# Altium project TablePCB2.PrjPcb
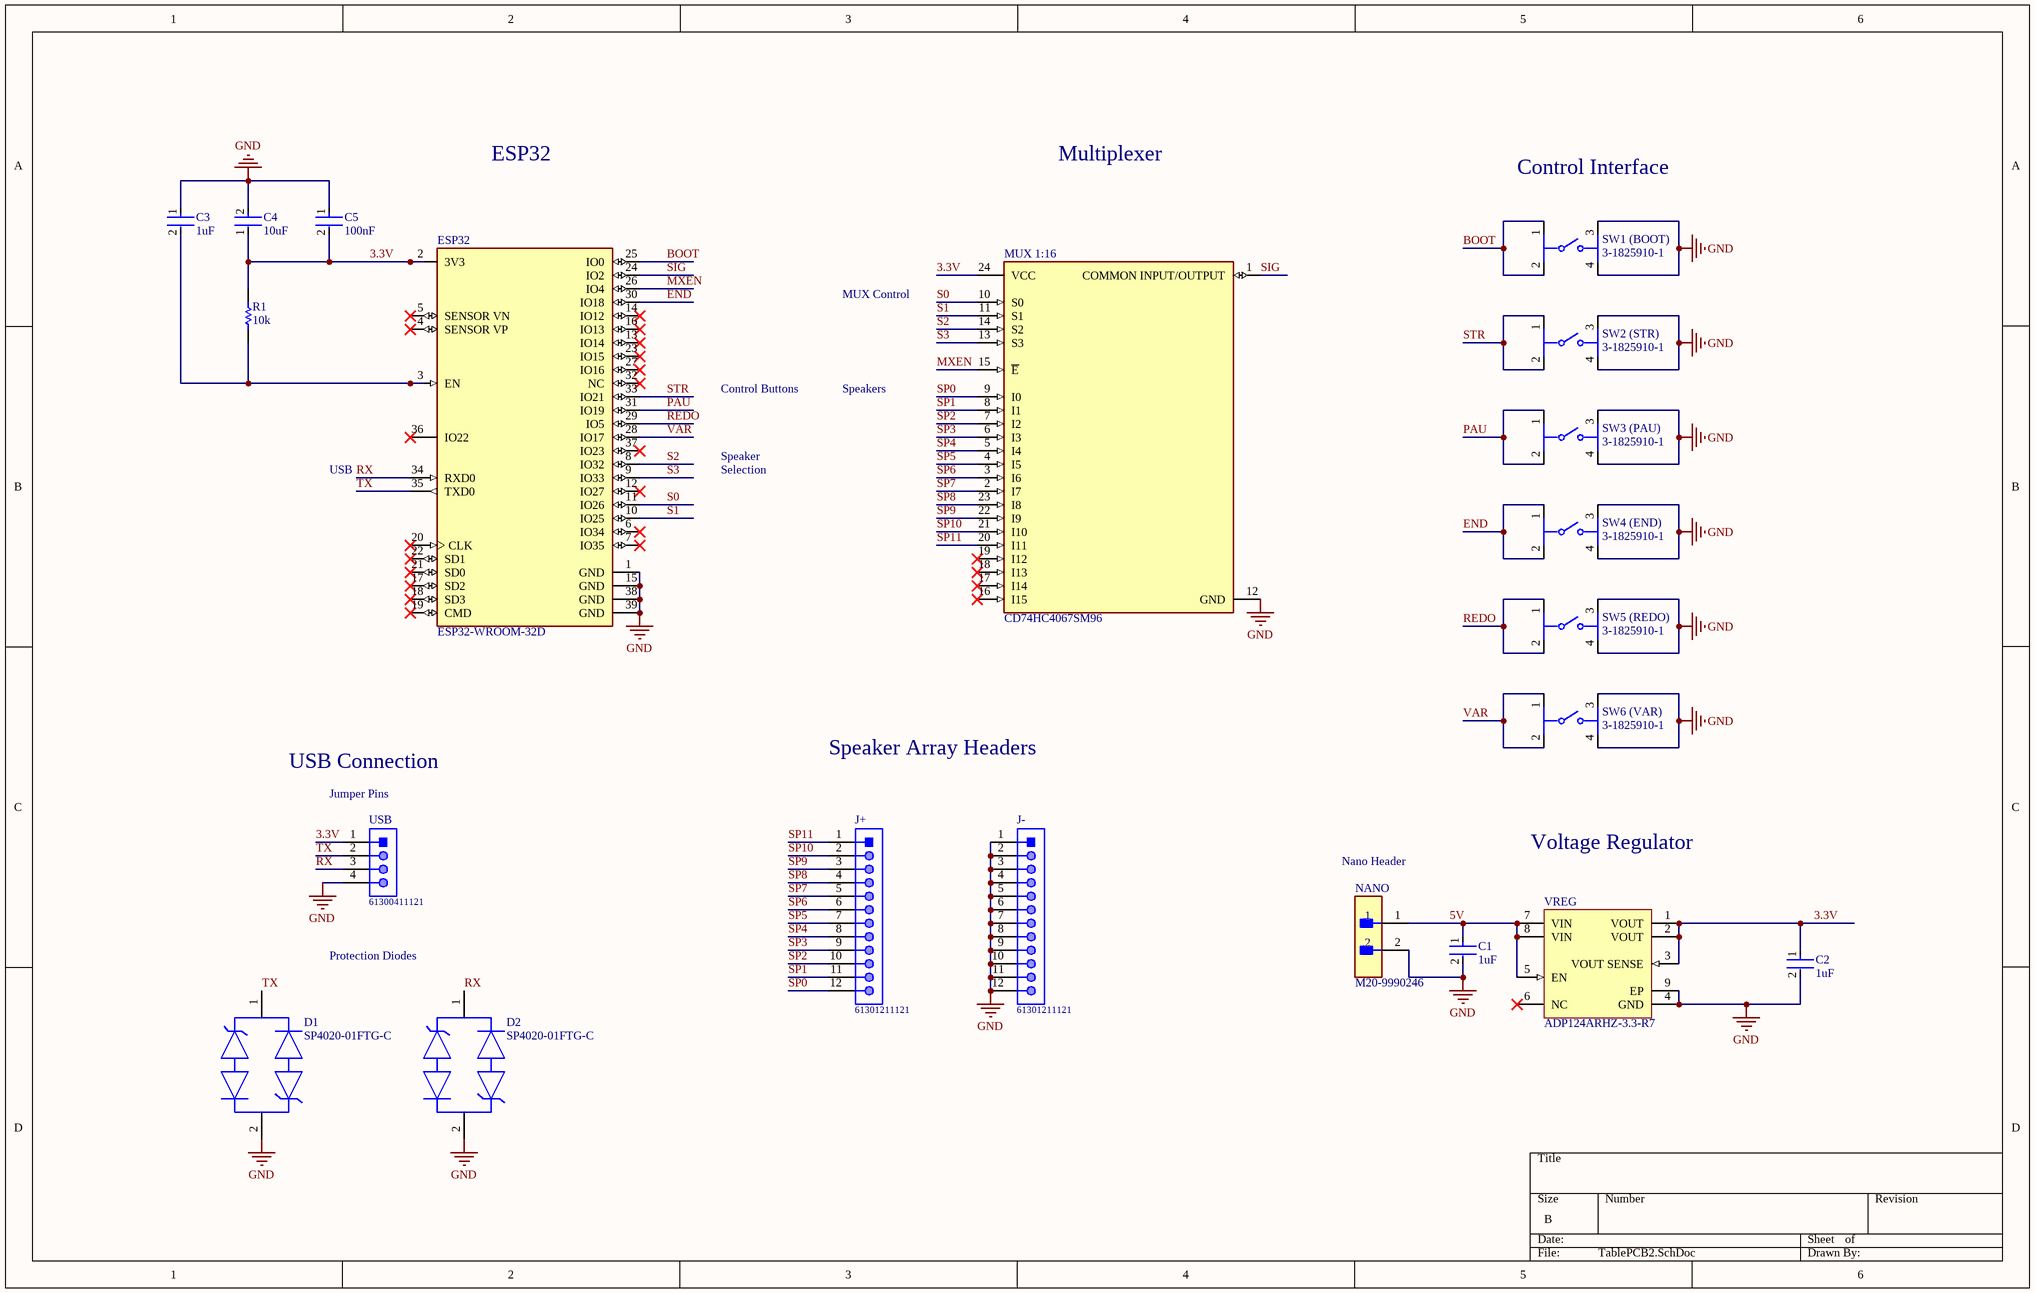
[diagram p0: TablePCB2.SchDoc]
1 sheet, 21 parts. Net scope: global (net labels, ports and power ports of the same name join across sheets).
Board file: TablePCB2.PcbDoc

## Sheet TablePCB2.SchDoc
size B; SheetNumber: 1; SheetTotal: 1

### Parts
C1  1uF  [FP-GRM15-0_1-MFG]
C2  1uF  [FP-GRM15-0_1-MFG]
C3  1uF  [FP-GRM15-0_1-MFG]
C4  10uF  [FP-C1608-080-0_1-MFG]
C5  100nF  [FP-C0402-BB-MFG]
D1  SP4020-01FTG-C  [FP-SP4020-MFG]
D2  SP4020-01FTG-C  [FP-SP4020-MFG]
ESP32  ESP32-WROOM-32D  [FP-ESP32-WROOM-32D-MFG]
J+  61301211121  [61301211121]
J-  61301211121  [61301211121]
MUX_1:16  CD74HC4067SM96  [FP-DB0024A-IPC_C]
NANO  M20-9990246  [FP-M20-9990246-MFG]
R1  10k  [RESC1609X55X30LL15T15]
SW1_(BOOT)  3-1825910-1  [FP-3-1825910-1-MFG]
SW2_(STR)  3-1825910-1  [FP-3-1825910-1-MFG]
SW3_(PAU)  3-1825910-1  [FP-3-1825910-1-MFG]
SW4_(END)  3-1825910-1  [FP-3-1825910-1-MFG]
SW5_(REDO)  3-1825910-1  [FP-3-1825910-1-MFG]
SW6_(VAR)  3-1825910-1  [FP-3-1825910-1-MFG]
USB  61300411121  [61300411121]
VREG  ADP124ARHZ-3.3-R7  [ADI-RH-8-1_N]

### Nets
GND: C1.2 C2.2 C3.1 C4.2 C5.1 D1.2 D2.2 ESP32.1(GND) ESP32.15(GND) ESP32.38(GND) ESP32.39(GND) J-.1 J-.2 J-.3 J-.4 J-.5 J-.6 J-.7 J-.8 J-.9 J-.10 J-.11 J-.12 MUX_1:16.12(GND) NANO.2 SW1_(BOOT).3 SW1_(BOOT).4 SW2_(STR).3 SW2_(STR).4 SW3_(PAU).3 SW3_(PAU).4 SW4_(END).3 SW4_(END).4 SW5_(REDO).3 SW5_(REDO).4 SW6_(VAR).3 SW6_(VAR).4 USB.4 VREG.4(GND) VREG.9(EP)
3.3V: C2.1 C4.1 C5.2 ESP32.2(3V3) MUX_1:16.24(VCC) R1.2 USB.1 VREG.1(VOUT) VREG.2(VOUT) VREG.3(VOUT_SENSE)
5V: C1.1 NANO.1 VREG.5(EN) VREG.7(VIN) VREG.8(VIN)
BOOT: ESP32.25(IO0) SW1_(BOOT).1 SW1_(BOOT).2
END: ESP32.30(IO18) SW4_(END).1 SW4_(END).2
MXEN: ESP32.26(IO4) MUX_1:16.15(~{E})
PAU: ESP32.31(IO19) SW3_(PAU).1 SW3_(PAU).2
REDO: ESP32.29(IO5) SW5_(REDO).1 SW5_(REDO).2
RX: D2.1 ESP32.34(RXD0) USB.3
S0: ESP32.11(IO26) MUX_1:16.10(S0)
S1: ESP32.10(IO25) MUX_1:16.11(S1)
S2: ESP32.8(IO32) MUX_1:16.14(S2)
S3: ESP32.9(IO33) MUX_1:16.13(S3)
SIG: ESP32.24(IO2) MUX_1:16.1(COMMON_INPUT/OUTPUT)
SP0: J+.12 MUX_1:16.9(I0)
SP1: J+.11 MUX_1:16.8(I1)
SP2: J+.10 MUX_1:16.7(I2)
SP3: J+.9 MUX_1:16.6(I3)
SP4: J+.8 MUX_1:16.5(I4)
SP5: J+.7 MUX_1:16.4(I5)
SP6: J+.6 MUX_1:16.3(I6)
SP7: J+.5 MUX_1:16.2(I7)
SP8: J+.4 MUX_1:16.23(I8)
SP9: J+.3 MUX_1:16.22(I9)
SP10: J+.2 MUX_1:16.21(I10)
SP11: J+.1 MUX_1:16.20(I11)
STR: ESP32.33(IO21) SW2_(STR).1 SW2_(STR).2
TX: D1.1 ESP32.35(TXD0) USB.2
VAR: ESP32.28(IO17) SW6_(VAR).1 SW6_(VAR).2
NetC3_2: C3.2 ESP32.3(EN) R1.1

Not connected (* = marked no-connect by the designer): ESP32 4(SENSOR_VP)* 5(SENSOR_VN)* 6(IO34)* 7(IO35)* 12(IO27)* 13(IO14)* 14(IO12)* 16(IO13)* 17(SD2)* 18(SD3)* 19(CMD)* 20(CLK)* 21(SD0)* 22(SD1)* 23(IO15)* 27(IO16)* 32(NC)* 36(IO22)* 37(IO23)*; MUX_1:16 16(I15)* 17(I14)* 18(I13)* 19(I12)*; VREG 6(NC)*

### Notes on the sheet
- ESP32
- Multiplexer
- Control Interface
- MUX Control
- Control Buttons
- Speakers
- USB
- Speaker
- Selection
- USB Connection
- Speaker Array Headers
- (near USB) Jumper Pins
- Nano Header
- Voltage Regulator
- Protection Diodes

### Library data of the parts
C1-C3 = CMP-2008-04556-2: CAP CER 1UF 10V X5R 0402; Manufacturer Part Number: GRM155R61A105KE15D; Manufacturer: Murata; Material: Ceramic; Tolerance: 10%; Temperature Coefficient: 15%; Octopart: https://octopart.com/grm155r61a105ke15d-murata-197442; Lead Free: Yes; ComponentLink2Description: Datasheet; Temperature: -55°C to +85°C; Temperature Range High: +85°C; Height: 0.55mm; Capacitance: 1uF; Ipc Land Pattern Name: CAPC10050X50; ComponentLink2URL: https://search.murata.co.jp/Ceramy/image/img/A01X/G101/ENG/GRM155R61A105KE15-01A.pdf; Temperature Range Low: -55°C; Device Class L2: Capacitors; Voltage Rating: 10V; RoHS: TRUE; Device Class L1: Passive Components; Device Class L3: Ceramic Capacitors; Temperature Characteristic: X5R; Mouser Description: 0402 1 uF 10 V ±10% Tolerance X5R Surface Mount Multilayer Ceramic Capacitor; Automotive: No; Package: GRM15-0.1; Digikey Description: CAP CER 1UF 10V X5R 0402; Value: 1uF; Category: Cap
C4 = CMP-2000-04979-3: Multilayer Ceramic Capacitors 10μF ±10% 10V X5R SMD 0603; Dielectric Material: Ceramic; Construction: Flat; Height: 0.8mm; Thickness: 0.035inch; Case Code (Metric): 1608; Radiation Hardening: No; Number of Pins: 2; Voltage Rating (DC): 10V; Depth: 0.8mm; Voltage: 10V; RoHS Compliant: Yes; Voltage Rating: 10V; Package Quantity: 1; Resistor Type: Ceramic; Termination: SMD/SMT; Lead Free: Lead Free; REACH SVHC: No SVHC; Tolerance: 10%; Mount: Surface Mount; Series: C; Packaging: Tape and Reel; Width: 0.8mm; Dielectric: X5R; Weight: 7.1E-05oz; Length: 1.6mm; Max Operating Temperature: 85°C; Case Code (Imperial): 0603; Case/Package: 0603; Min Operating Temperature: -55°C; Capacitance: 10uF
C5 = CMP-2008-02046-2: CAP CER 0.1UF 10V X5R 0402; Manufacturer: Kemet; Manufacturer Part Number: C0402C104K8PACTU; Material: Ceramic; Capacitance: 0.10 μF; Temperature Coefficient: 15%; Tolerance: 0.1; Value: 0.10 μF; Package: C0402-BB; Temperature: -55°C to +125°C; ComponentLink2Description: Datasheet; Temperature Characteristic: X5R; Device Class L1: Passive Components; Height: 0.55mm; Lead Free: Yes; ComponentLink2URL: https://content.kemet.com/datasheets/KEM_C1002_X7R_SMD.pdf; Device Class L2: Capacitors; Temperature Range Low: -55°C; Temperature Range High: +125°C; RoHS: TRUE; Octopart: https://octopart.com/c0402c104k8pactu-kemet-140039; Automotive: No; Mouser Description: Capacitor 100 nF 10 VDC 0402; Category: Cap; Voltage Rating: 10 V; Digikey Description: CAP CER 0.1UF 10V X5R 0402; Ipc Land Pattern Name: CAPC10050X50; Device Class L3: Ceramic Capacitors
D1 D2 = CMP-08607-000034-1: TVS DIODE 3.3V 21.8V SOD323; Manufacturer: Littelfuse; Capacitance: 2.5pF; Peak Pulse Current: 30A; Number Of Channels: 1; Value: 2.5pF; Direction: Bidirectional; Standoff Height: 0mm; Breakdown Voltage: 3.5V; Peak Pulse Power: 750W; Reverse Standoff Voltage: 3.3V; Clamping Voltage: 21.8V; Package: SP4020; ComponentLink2Description: Datasheet; Height: 1mm; Ipc Land Pattern Name: SOD262130X90-2; Category: Diode; Mouser Description: SP4020 Series 3.3 V 30 A Bi-Directional SMT TVS Diode - SOD-323; Digikey Description: TVS DIODE 3.3V 21.8V SOD323; Temperature Range High: +125°C; Device Class L2: TVS Diodes; ComponentLink2URL: https://www.littelfuse.com/~/media/electronics/datasheets/tvs_diode_arrays/littelfuse_tvs_diode_array_sp4020_datasheet.pdf.pdf; Manufacturer Part Number: SP4020-01FTG-C; Lead Free: Yes; RoHS: TRUE; Device Class L3: unset; Temperature: -40°C to +125°C; Automotive: No; Octopart: https://octopart.com/sp4020-01ftg-c-littelfuse-30499898; Temperature Range Low: -40°C; Device Class L1: Circuit Protection
ESP32 = CMP-194065-000003-1: WIFI MODULE 32MBITS SPI FLASH; Manufacturer: Espressif Systems; Max Supply Voltage: 3.6V; Nominal Supply Current: 500mA; Max Frequency: 2484MHz; Number Of Adc Channels: 16; Number Of Gpio: 32; Interface: I2C,SPI,UART,Ethernet,I2S,Other; Data Rate: 150Mbits/s; Min Supply Voltage: 3V; Bandwidth: 72MHz; Sensitivity: -98dBm; Octopart: https://octopart.com/esp32-wroom-32d-espressif+systems-91040050; Package: ESP32-WROOM-32D; ComponentLink2URL: https://www.espressif.com/sites/default/files/documentation/esp32-wroom-32d_esp32-wroom-32u_datasheet_en.pdf; Lead Free: Yes; Category: UNK; Mouser Description: Wi-Fi/BT BLE Module ESP32-D0WD, SPI Flash, UART, P; Device Class L1: Integrated Circuits (ICs); RoHS: TRUE; Temperature Range Low: -40°C; ComponentLink2Description: Datasheet; Digikey Description: WIFI MODULE 32MBITS SPI FLASH; Height: 3.2mm; Temperature: -40°C to +85°C; Manufacturer Part Number: ESP32-WROOM-32D; Device Class L3: Transceivers; Device Class L2: RF Semiconductors and Devices; Temperature Range High: +85°C; Automotive: No
J+ J- = CMP-1502-01086-1: THT Vertical Pin Header WR-PHD, Pitch 2.54 mm, Single Row, 12 pins; Manufacturer: Wurth Elektronik; Pin Number: 12; Gender: Male; Working Voltage: 250VAC; Rated Current: 3A; Withstanding Voltage: 500VAC; Pitch: 2.54mm; Contact Resistance: 20mOhm; Orientation: Vertical; Package Reference: 61301211121; Packaging: Bag; Operating Temperature: -40to105degC; Mounting Technology: THT; Part Number: 61301211121; Manufacturer URL: http://www.we-online.de; Row Number: Single; Publisher: WurthElektronik; Datasheet URL: https://katalog.we-online.de/em/datasheet/6130xx11121.pdf
MUX_1:16 = CMP-04892-000038-1: IC MUX/DEMUX 1X16 24SSOP; Supply Type: Single; High Level Output Current: 25mA; Min Supply Voltage: 2V; Number of Circuits: 16; Max Supply Voltage: 6V; Number of Channels: 1; Turn-On Delay Time: 300ns; Max Supply Current: 8uA; Bandwidth: 89MHz; Turn-Off Delay Time: 290ns; Propagation Delay: 75ns; Logic Function: Multiplexer; On-State Resistance: 160R; Polarity: Non-Inverting; Width: 5.3mm; Case/Package: SSOP; Max Operating Temperature: 125°C; Mount: Surface Mount; Min Operating Temperature: -55°C; REACH SVHC: No SVHC; Contact Plating: Gold; Max Output Current: 25mA; Weight: 0.006081oz; Height: 1.95mm; Package Quantity: 2000; Length: 8.2mm; Lead Free: Lead Free; Operating Supply Current: 8uA; Packaging: Tape and Reel; Series: 74HC; Low Level Output Current: 25mA; Number of Outputs: 1; Termination: SMD/SMT; Number of Inputs: 16; Number of Bits: 16; Radiation Hardening: No; Number of Pins: 24
NANO = CMP-15831-000009-1: CONN HEADER VERT 2POS 2.54MM; Manufacturer: Harwin; Conn Gender: Male; Conn Orientation: Vertical; Number Of Contacts: 2; Current Rating: 3A; ComponentLink2URL: https://cdn.harwin.com/pdfs/M20-999.pdf; ComponentLink2Description: Datasheet; Package: M20-9990246; Temperature: -40°C to +105°C; Octopart: https://octopart.com/m20-9990246-harwin-2590635; Mouser Description: 2.54mm (0.1") Pitch SIL Vertical PC Tail Pin Header, 6.1mm mating pin height, tin, 2 contacts; Temperature Range High: +105°C; Device Class L1: Connectors; RoHS: TRUE; Automotive: No; Height: 8.99mm; Number Of Rows: 1; Contact Material: Tin,Nickel; Category: Conn; Pitch: 2.54mm; Lead Free: Yes; Digikey Description: CONN HEADER VERT 2POS 2.54MM; Manufacturer Part Number: M20-9990246; Temperature Range Low: -40°C; Device Class L3: unset; Device Class L2: Headers and Wire Housings
R1 = CMP-1012-00623-3: Chip Resistor, 10 KOhm, +/- 1%, 0.1 W, -55 to 155 degC, 0603 (1608 Metric), RoHS, Tape and Reel; Manufacturer: Panasonic; Voltage Rating: 75V; Case\/Package: 0603; Power Rating: 100mW; Resistance: 10KOhm; Temperature Coefficient: 100ppm\/degreesC; Number of Pins: 2; Package Reference: 603; Depth: 0.8mm; Mount: SurfaceMount; Package Description: 2-Pin Surface Mount Device, Body 1.6 x 0.85 mm; Datasheet Version: 02/2017; Length: 1.6mm; Lead Free: LeadFree; Height: 0.45mm; Number of Terminations: 2; Max Power Dissipation: 100mW; Min Operating Temperature: -55degC; Datasheet URL: https://industrial.panasonic.com/cdbs/www-data/pdf/RDA0000/AOA0000C304.pdf; Termination: SMD/SMT; Case Code (Metric): 1608; Case Code (Imperial): 0603; Tolerance: 1%; Max Operating Temperature: 155degC; RoHSCompliant: true; Voltage Rating (DC): 75V; Radiation Hardening: No; Packaging: TapeandReel; Composition: ThickFilm; Mounting Technology: SurfaceMount; Manufacturer URL: http://www.panasonic.com/; Width: 0.031inch; REACH SVHC: NoSVHC; Contact Plating: Tin; Military Standard: Not; Package Quantity: 1
SW1_(BOOT) SW2_(STR) SW3_(PAU) SW4_(END) SW5_(REDO) SW6_(VAR) = CMP-03407-000001-1: SWITCH TACTILE SPST-NO 0.05A 24V; Manufacturer: TE Connectivity; Operating Force: 160gf; Contact Current Rating: 50mA; Contact Resistance: 100mΩ; Electromechanical Life: 100000Cycles; Device Class L1: Electromechanical; ComponentLink2URL: https://www.te.com/commerce/DocumentDelivery/DDEController?Action=srchrtrv&DocNm=1825910&DocType=Customer+Drawing&DocLang=English; Category: Switch; Device Class L2: Switches; Temperature: -35°C to +85°C; RoHS: TRUE; Mount: Through Hole; Manufacturer Part Number: 3-1825910-1; Automotive: No; Lead Free: Yes; Device Class L3: Tactile Switches; ComponentLink2Description: Datasheet; Temperature Range High: +85°C; Height: 17.3mm; Package: 0; Temperature Range Low: -35°C; Throw Configuration: SPST-NO; Digikey Description: SWITCH TACTILE SPST-NO 0.05A 24V; Octopart: https://octopart.com/3-1825910-1-te+connectivity-46506874
USB = CMP-1502-01064-1: THT Vertical Pin Header WR-PHD, Pitch 2.54 mm, Single Row, 4 pins; Manufacturer: Wurth Elektronik; Withstanding Voltage: 500VAC; Rated Current: 3A; Working Voltage: 250VAC; Pin Number: 4; Gender: Male; Contact Resistance: 20mOhm; Pitch: 2.54mm; Manufacturer URL: http://www.we-online.de; Operating Temperature: -40to105degC; Packaging: Bag; Mounting Technology: THT; Package Reference: 61300411121; Datasheet URL: https://katalog.we-online.de/em/datasheet/6130xx11121.pdf; Publisher: WurthElektronik; Part Number: 61300411121; Row Number: Single; Orientation: Vertical
VREG = CMP-0786-00223-1: 500 mA, Low Quiescent Current, CMOS Linear Regulator, 2.3 to 5.5 V Vin, 3.3 V Vout, Industrial, 8-pin SOP (RH-8-1), Reel; Manufacturer: Analog Devices; Iout max: 500mA; Preset Vout Values (V): 3.3; Supply Current IGND @ Small Load: 45uA; Vin (min) (V): 2.3; Vin (max) (V): 5.5; ComponentLink2URL: http://www.analog.com/static/imported-files/data_sheets/ADP124_125.pdf; DatasheetVersion: Rev. C; ComponentLink1URL: http://www.analog.com/en/index.html; Code_JEDEC: MO-187-AA-T; PackageVersion: 071008-A, 08/2008; PackageDescription: 8-Pin Mini Small Outline Package, Body 3 x 3 mm, Pitch 0.65 mm; ComponentLink3URL: http://www.analog.com/static/imported-files/packages/PKG_PDF/MSOP_ED(RH)/RH_8_1.pdf; ComponentLink2Description: Datasheet; PartNumber: ADP124ARHZ-3.3-R7; Packing: Reel; ComponentLink4URL: Product URL:http://www.analog.com/en/ADP124/productSearch.html; ComponentLink3Description: Package Specification; ComponentLink1Description: Manufacturer URL; Mounting Technology: Surface Mount; ComponentLink4Description: URL Link1; PackageReference: RH-8-1